# Altium schematic sheet Power.SchDoc
size A3; Author: Jean Callus; DrawnBy: Jean Callus; Organization: RATON; Revision: 0; SheetNumber: 3
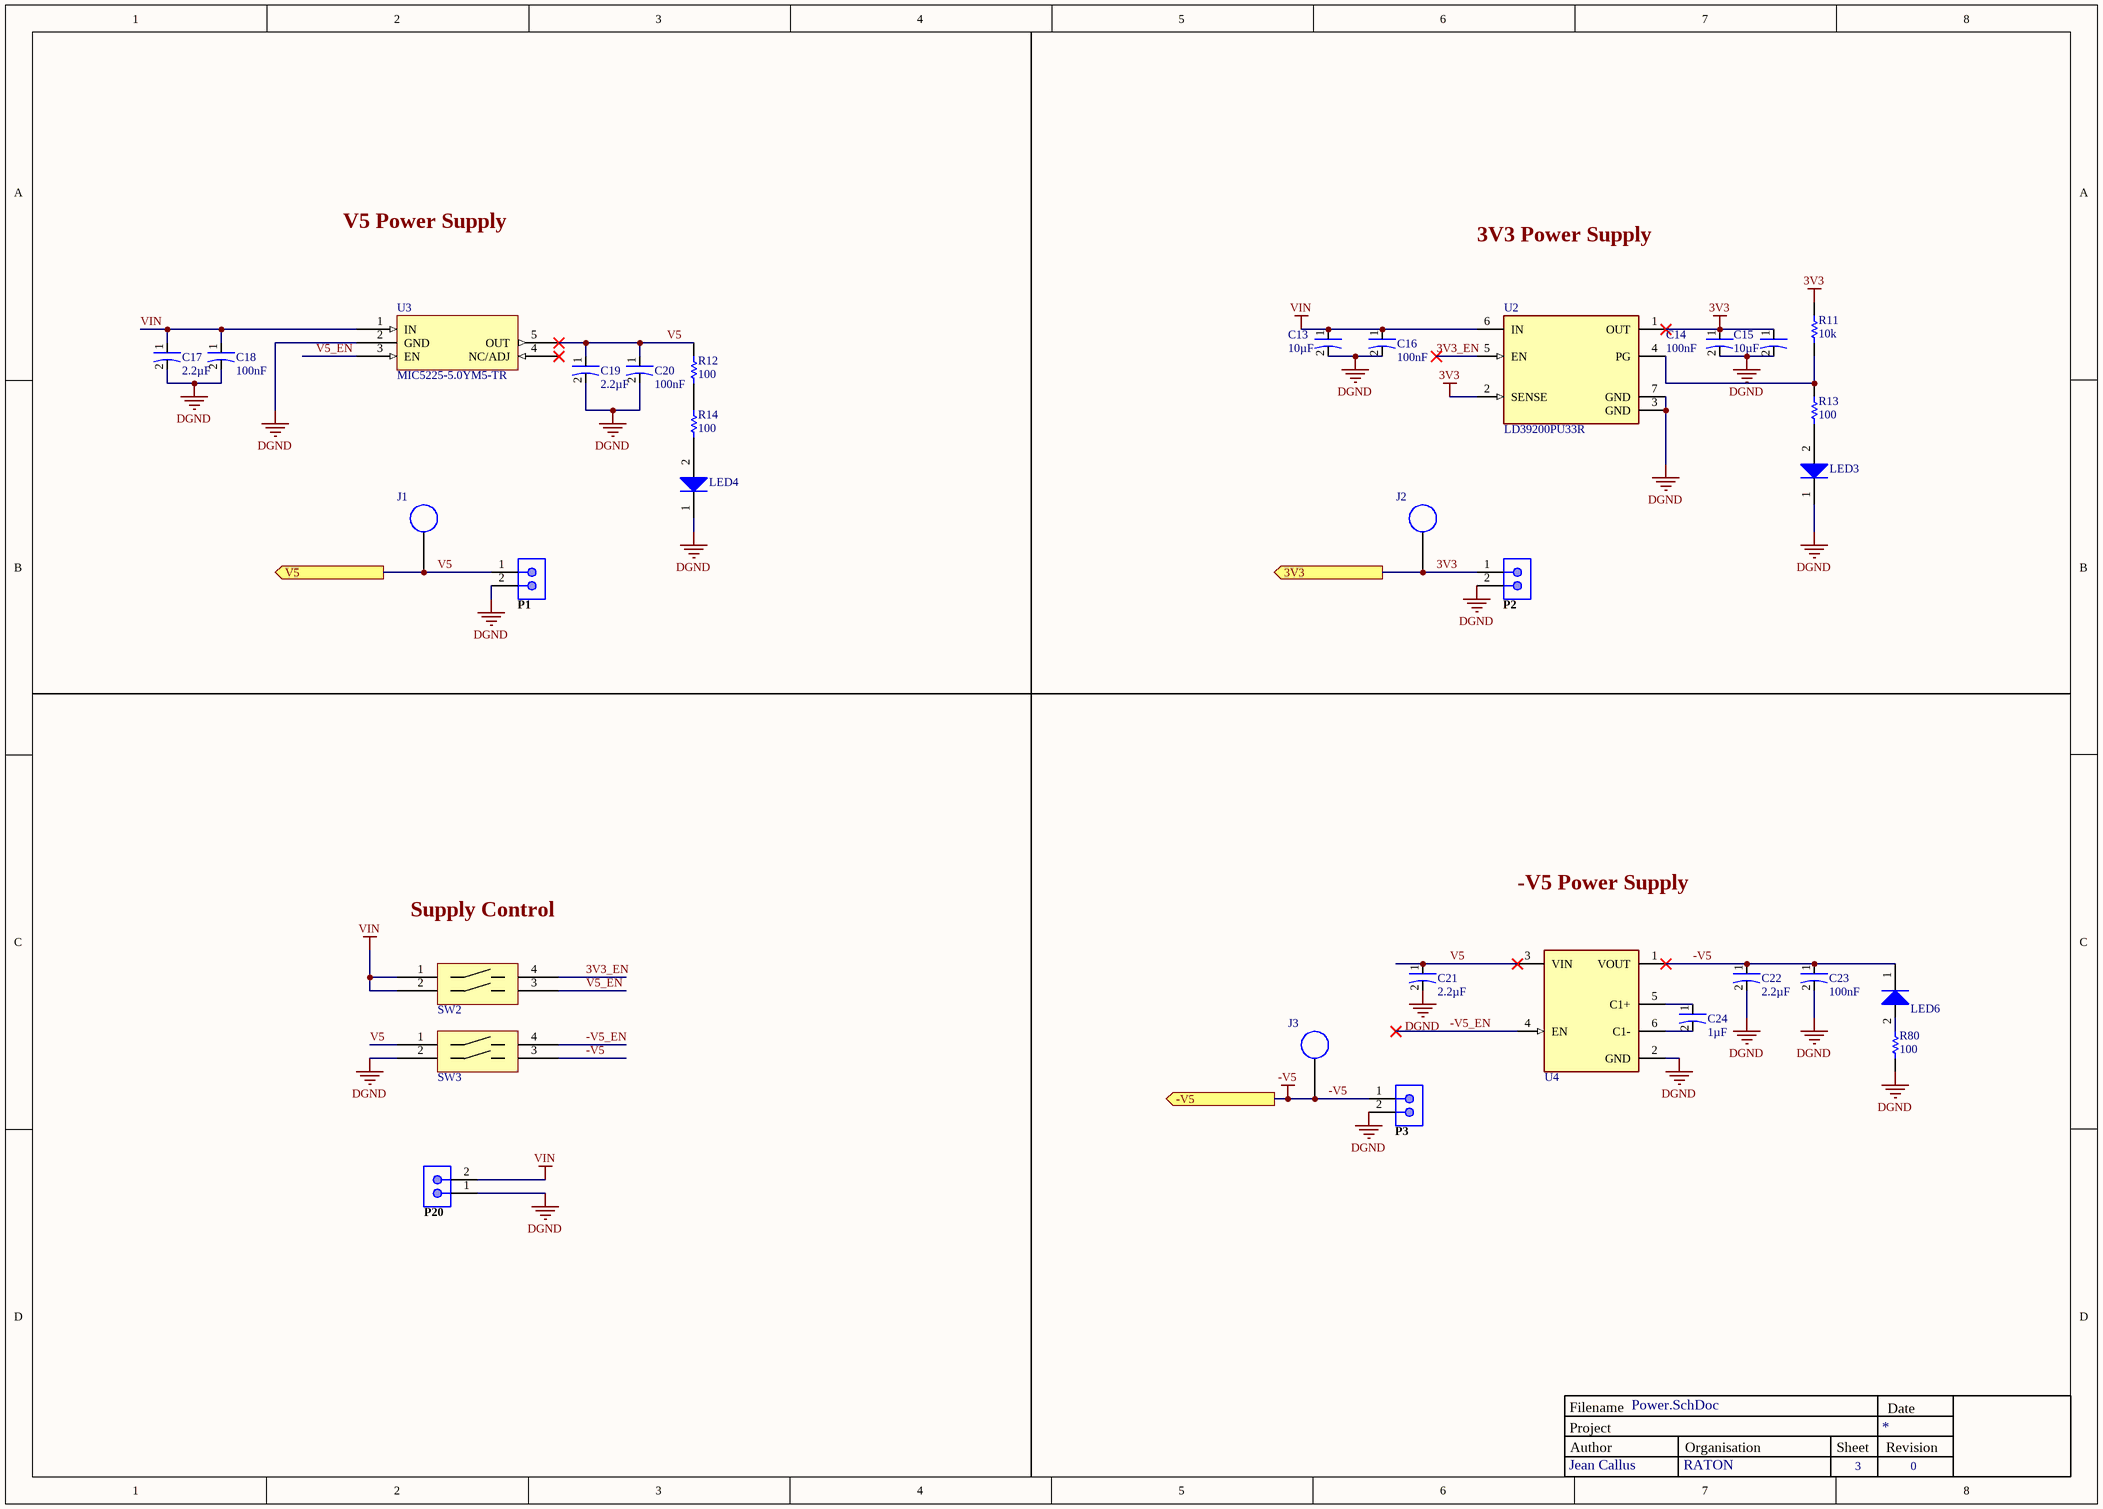
[diagram p0: Power.SchDoc]

## Parts
C13  value 10µF  [0402-M]  (hidden comment: CAP 10uF CER 0402 6.3V X5R 20%)
C14  value 100nF  [0805-M]  (hidden comment: CAP 0.1uF CER 0805 50V X7R 10%)
C15  value 10µF  [0402-M]  (hidden comment: CAP 10uF CER 0402 6.3V X5R 20%)
C16  value 100nF  [0805-M]  (hidden comment: CAP 0.1uF CER 0805 50V X7R 10%)
C17  value 2.2µF  [0402-M]  (hidden comment: CAP 2.2uF CER 0402 25V X5R 10%)
C18  value 100nF  [0805-M]  (hidden comment: CAP 0.1uF CER 0805 50V X7R 10%)
C19  value 2.2µF  [0402-M]  (hidden comment: CAP 2.2uF CER 0402 25V X5R 10%)
C20  value 100nF  [0805-M]  (hidden comment: CAP 0.1uF CER 0805 50V X7R 10%)
C21  value 2.2µF  [0402-M]  (hidden comment: CAP 2.2uF CER 0402 25V X5R 10%)
C22  value 2.2µF  [0402-M]  (hidden comment: CAP 2.2uF CER 0402 25V X5R 10%)
C23  value 100nF  [0805-M]  (hidden comment: CAP 0.1uF CER 0805 50V X7R 10%)
C24  value 1µF  [0402-M]  (hidden comment: CAP 1uF CER 0402 25V X5R 20%)
J1  151-203-RC  [151-203-RC-Footprint-1]  (value not drawn)
J2  151-203-RC  [151-203-RC-Footprint-1]  (value not drawn)
J3  151-203-RC  [151-203-RC-Footprint-1]  (value not drawn)
LED3  LED 0603 Green 20mA 1.8V  [0603 Generic]  (value not drawn)
LED4  LED 0603 Green 20mA 1.8V  [0603 Generic]  (value not drawn)
LED6  LED 0603 Green 20mA 1.8V  [0603 Generic]  (value not drawn)
P1  GENERIC 2PIN HEADER MALE  [GENERIC 2PIN HEADER 0]  (value not drawn)
P2  GENERIC 2PIN HEADER MALE  [GENERIC 2PIN HEADER 0]  (value not drawn)
P3  GENERIC 2PIN HEADER MALE  [GENERIC 2PIN HEADER 0]  (value not drawn)
P20  GENERIC 2PIN HEADER MALE  [GENERIC 2PIN HEADER 0]  (value not drawn)
R11  value 10k  [0402-M]  (hidden comment: RES 10k 0402 63mW 5%)
R12  value 100  [0805-L]  (hidden comment: RES 100 0805 125mW 1%)
R13  value 100  [0805-L]  (hidden comment: RES 100 0805 125mW 1%)
R14  value 100  [0805-L]  (hidden comment: RES 100 0805 125mW 1%)
R80  value 100  [0805-L]  (hidden comment: RES 100 0805 125mW 1%)
SW2  210-2MS  [210-2MS-Footprint-1]  (value not drawn)
SW3  210-2MS  [210-2MS-Footprint-1]  (value not drawn)
U2  LD39200PU33R  [FP-DFN6-7946637-MFG]
U3  MIC5225-5.0YM5-TR  [SOT95P280X145-5N]
U4  LM2776DBVR  [FP-DBV0006A-IPC_B]  (value not drawn)

## Ports
3V3 (out), -V5 (out), V5 (out)

## Nets
3V3: C14.1(Anode) C15.1(Anode) J2.1 P2.1 R11.2 U2.1(OUT) U2.2(SENSE) ; port 3V3
-V5: C22.1(Anode) C23.1(Anode) J3.1 LED6.1 P3.1 SW3.3 U4.1(VOUT) ; port -V5
DGND: C13.2(Cathode) C14.2(Cathode) C15.2(Cathode) C16.2(Cathode) C17.2(Cathode) C18.2(Cathode) C19.2(Cathode) C20.2(Cathode) C21.2(Cathode) C22.2(Cathode) C23.2(Cathode) LED3.1 LED4.1 P1.2 P2.2 P3.2 P20.1 R80.1 SW3.2 U2.3(GND) U2.7(GND) U3.2(GND) U4.2(GND)
VIN: C13.1(Anode) C16.1(Anode) C17.1(Anode) C18.1(Anode) P20.2 SW2.1 SW2.2 U2.6(IN) U3.1(IN)
3V3_EN: SW2.4 U2.5(EN)
-V5_EN: SW3.4 U4.4(EN)
V5: C19.1(Anode) C20.1(Anode) C21.1(Anode) J1.1 P1.1 R12.2 SW3.1 U3.5(OUT) U4.3(VIN) ; port V5
V5_EN: SW2.3 U3.3(EN)
NetC24_1: C24.1(Anode) U4.5(C1+)
NetC24_2: C24.2(Cathode) U4.6(C1-)
NetLED3_2: LED3.2 R13.1
NetLED4_2: LED4.2 R14.1
NetLED6_2: LED6.2 R80.2
NetR11_1: R11.1 R13.2 U2.4(PG)
NetR12_1: R12.1 R14.2

Not connected (* = marked no-connect by the designer): U3 4(NC/ADJ)*

## Notes on the sheet
- V5 Power Supply
- 3V3 Power Supply
- Supply Control
- -V5 Power Supply
- Project
- Filename
- Author
- Organisation
- Sheet
- Revision
- Date
  Date

## Library data of the parts
C13 C15 = CAP 10uF CER 0402 6.3V X5R 20%-2: CAP-10uF-CER-0402-6.3V-X5R-20%; Manufacturer: Generic; Type: SMD; Bin: F1-C2-10; Supplier Part Number 1: 80-C0402C106M9P; Source: Capacitor Library.SchLib; Case/Package: 0402; Supplier 1: Mouser; Design Item ID: CAP 10uF CER 0402 6.3V X5R 20%
C14 C16 C18 C20 C23 = CAP 0.1uF CER 0805 50V X7R 10%-2: CAP-0.1uF-CER-0805-50V-X7R-10%; Manufacturer: Generic; Bin: 8-CAP; Type: SMD; Source: Capacitor Library.SchLib; Status: Active; Design Item ID: CAP 0.1uF CER 0805 50V X7R 10%; Supplier 1: Mouser; Supplier Part Number 1: 80-C0805C104K5R; Case/Package: 0805; Datasheet: http://www.kemet.com/Lists/ProductCatalog/Attachments/53/KEM_C1002_X7R_SMD.pdf
C17 C19 C21 C22 = CAP 2.2uF CER 0402 25V X5R 10%-2: CAP-2.2uF-CER-0402-25V-X5R-10%; Manufacturer: Generic; Bin: F1-C1-9; Type: SMD; Supplier Part Number 1: 810-C1005X5R1E225K; Status: Active; Supplier 1: Mouser; Source: Capacitor Library.SchLib; Design Item ID: CAP 2.2uF CER 0402 25V X5R 10%; Case/Package: 0402
C24 = CAP 1uF CER 0402 25V X5R 20%-2: CAP-1uF-CER-0402-25V-X5R-20%; Manufacturer: Generic; Bin: 5-FMC-CAP; Type: SMD; Design Item ID: CAP 1uF CER 0402 25V X5R 20%; Source: Capacitor Library.SchLib; Supplier 1: Mouser; Status: Active; Supplier Part Number 1: 963-TMK105CC6105MV-F; Case/Package: 0402
J1-J3 = CMP-002-00000-2: PCB-Probe-Ring; Color: Black
LED3 LED4 LED6 = LED 0603 Green 20mA 1.8V-1: LED-0603-Green-20mA-1.8V-STOCK; Manufacturer: Generic; Bin: F2-DM1-1; Type: SMD; Design Item ID: LED 0603 Green 20mA 1.8V; Status: Active; Supplier 1: Mouser; Supplier Part Number 1: 645-598-8060-107F; Case/Package: 0603; Source: Diode Library.SchLib
P1-P3 P20 = GENERIC 2PIN HEADER MALE-2: CONN MAL TH 2 0Deg HEADER; Bin: B3-J5; Manufacturer: Generic; Design Item ID: GENERIC 2PIN HEADER MALE; Type: TH; Status: Active; Source: Connector Library.SchLib; Case/Package: n/a PIN
R11 = RES 10k 0402 63mW 5%-1: RES-10k-0402-63mW-5%; Manufacturer: Generic; Bin: F1-R7-9; MAPPING: 1(2,1,11.5k); Design Item ID: RES 10k 0402 63mW 5%; Type: SMD; Status: Active; Case/Package: 0402; Source: Resistor Library.SchLib
R12-R14 R80 = RES 100 0805 125mW 1%-1: RES-100-0805-125mW-1%; Manufacturer: Generic; Bin: F1-R11-6; MAPPING: 1(2,1,10k); Status: Active; Case/Package: 0805; Source: Resistor Library.SchLib; Type: SMD; Design Item ID: RES 100 0805 125mW 1%
SW2 SW3 = CMP-01293-3: SWITCH DIP SPST 2 100mA 50V; Actuator Type: Slide (Standard); Electrical Life: 1000Cycles; Number of Positions: 2; Washable: No; Pitch: 0.1inch; Voltage Rating (DC): 20V; Terminal Pitch: 2.54mm; Contact Material: Copper; Length: 0.258inch; Termination: PC Pin; Lead Free: Lead Free; Max Current Rating: 100mA; Throw Configuration: SPST; Packaging: Rail/Tube; Current Rating: 100mA; Orientation: Straight; Min Operating Temperature: -40°C; Contact Plating: Gold,Tin; Max Operating Temperature: 85°C; Package Quantity: 85; Mount: Through Hole
U2 = CMP-01296-4: STMICROELECTRONICS - LD39200PU33R - LDO, FIXED, 3.3V, 2A, -40 TO 125DEG C; Bin: NR; Case/Package: 6-pin DFN; Status: NR; Manufacturer: STMicroelectronics; Type: SMD; Supplier Part Number1: NR; Supplier1: NR
U3 = CMP-01298-2: MICROCHIP - MIC5225-5.0YM5-TR - Fixed LDO Voltage Regulator, 2.3V to 16V, 310mV Dropout, 5Vout, 150mAout, SOT-23-5; Bin: NR; Case/Package: SOT-23-5; Datasheet: NR; Manufacturer: Microchip; Status: NR; Supplier1: NR; Supplier Part Number1: NR; Type: SMD
U4 = LM2776DBVR-7: Charge Pump Negative Voltage; Manufacturer: Texas Instruments; Case/Package: 6 SOT-23; Status: Active; Type: SMD